# Altium schematic sheet 4-20mA.SchDoc
size A4; SheetNumber: 5; SheetTotal: 6
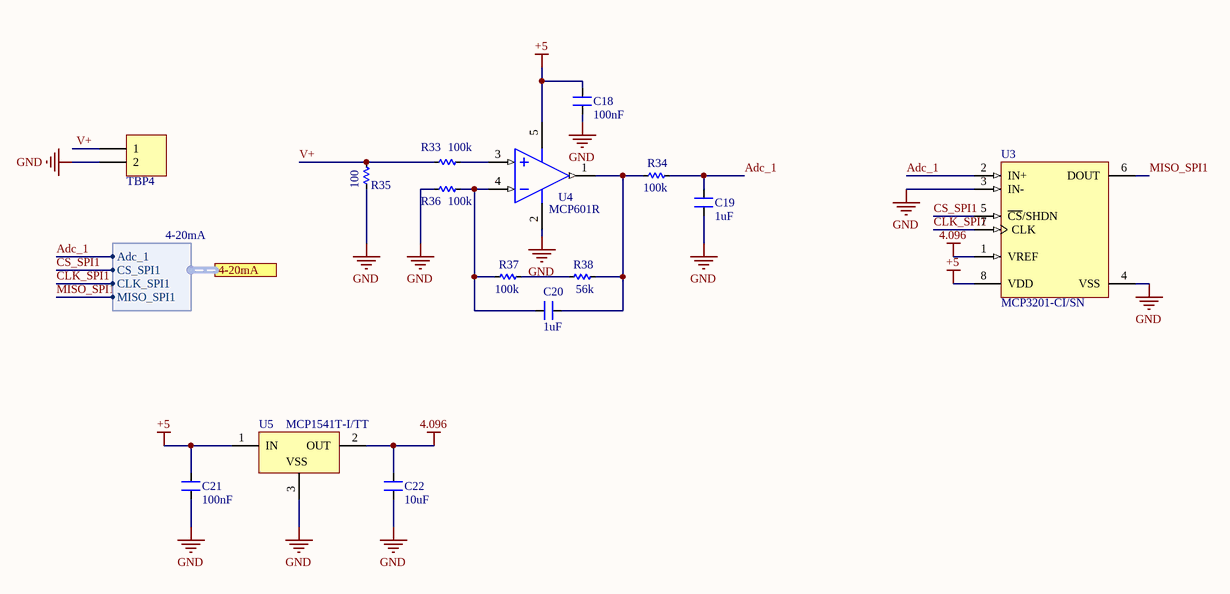
[diagram p0: 4-20mA.SchDoc]

## Parts
C18  100nF  [CN-SMD-0603]
C19  1uF  [CN-SMD-0603]
C20  1uF  [CN-SMD-0603]
C21  100nF  [CN-SMD-0603]
C22  10uF  [CN-SMD-0805]
R33  100k  [RES-SMD-0603]
R34  100k  [RES-SMD-0603]
R35  100  [RES-SMD-0603]
R36  100k  [RES-SMD-0603]
R37  100k  [RES-SMD-0603]
R38  56k  [RES-SMD-0603]
TBP4  WE-Terminal Blocks Plugable Type 691322310002  [Terminal_Blocks_Pluggable_Socket__Right_Angle__3.81_mm_Pitch__2_Position]  (value not drawn)
U3  MCP3201-CI/SN  [MCP3201]
U4  MCP601R  [MCP601]
U5  MCP1541T-I/TT  [MCP1541]

## Ports
4-20mA (harness 4-20mA)

## Harnesses
4-20mA: Adc_1, CS_SPI1, CLK_SPI1, MISO_SPI1

## Nets
4.096: C22.1 U3.1(VREF) U5.2(OUT)
+5: C18.2 C21.1 U3.8(VDD) U4.5(VSS) U5.1(IN)
GND: C18.1 C19.2 C21.2 C22.2 R35.2 R36.2 TBP4.2 U3.3(IN-) U3.4(VSS) U4.2(VDD) U5.3(VSS)
Adc_1: C19.1 R34.1 U3.2(IN+) ; port 4-20mA.Adc_1
CLK_SPI1: U3.7(CLK) ; port 4-20mA.CLK_SPI1
CS_SPI1: U3.5(~{CS}/SHDN) ; port 4-20mA.CS_SPI1
MISO_SPI1: U3.6(DOUT) ; port 4-20mA.MISO_SPI1
V+: R33.2 R35.1 TBP4.1
NetC20_1: C20.1 R34.2 R38.1 U4.1(VOUT)
NetC20_2: C20.2 R36.1 R37.2 U4.4(VIN-)
NetR33_1: R33.1 U4.3(VIN+)
NetR37_1: R37.1 R38.2

## Notes on the sheet
- Title
- Size:
- Date:
- A3
- Number:
- Time:
- Revision:
- Sheet
- of
- NICHIETSUVN.COM <http://NICHIETSUVN.COM>
- R&D
- File:

## Library data of the parts
C18-C22 = CN: Value: 33pF
R33-R38 = Res-SMD: Resistor; Manufacturer: Generic Components; Class: Passive; Published: 08/06/2000; Publisher: Altium Hobart Technology Centre
TBP4 = Terminal_Blocks_Pluggable_Socket__Right_Angle__3.81_mm_Pitch__2_Position: WR-TBL Terminal block - serie 322 - 3.81 mm; Manufacturer 1: W¨¹rth Elektronik eiSos GmbH; ComponentLink1 Description: Manufacturer; ComponentLink2 Description: Datasheet; NoPins: 02; Pcs 2: 1; ComponentLink1URL: http://www.we-online.com; ComponentLink2URL: http://katalog.we-online.de/em/datasheet/6913223100xx.pdf; Supplier 1: Digi-Key; Supplier Part Number 1: *; Supplier 2: https://www.thegioiic.com; Manufacturer Part Number 1: 691322310002; Supplier Part Number 2: https://www.thegioiic.com/products/kf-3-81-2-r-terminal-block-plug-in-han-pcb-2-chan-cong-3-81mm; Price 2: 2000
U3 = MCP3201-CI/SN: 2.7V 12-Bit A/D Converter with SPI Serial Interface, 8-Pin SOIC 150mil, C Performance Grade, Industrial Temperature; DatasheetVersion: revE, Dec-2008; Code_JEDEC: MS-012; Code_IPC: SOIC127P600-8; PackageVersion: revBB, Aug-2009; PackageDescription: 8-Lead Plastic Small Outline (SN) - Narrow, 3.90mm Body [SOIC]; PackageReference: SOIC-SN8; PartNumber: MCP3201-CI/SN
U4 = MCP601RT-I/OT: 2.7V to 6.0V Single Supply CMOS Operational Amplifier, 5-Pin SOT-23, Industrial Temperature, Tape and Reel; ComponentLink1Description: Manufacturer URL; ComponentLink2Description: Datasheet; DatasheetVersion: revG, Dec-2007; ComponentLink3URL: http://www.microchip.com/stellent/groups/techpub_sg/documents/packagingspec/en012702.pdf; ComponentLink3Description: Package Specification; ComponentLink1URL: http://www.microchip.com/; RevisionNote: URLs added.; Code_IPC: SOT23-5; PackageVersion: revBB, Aug-2009; PackageDescription: 5-Lead Plastic Small Outline Transistor (OT) [SOT-23]; ComponentLink2URL: http://ww1.microchip.com/downloads/en/DeviceDoc/21314g.pdf; PackageReference: SOT-23-OT5; PartNumber: MCP601RT-I/OT
U5 = MCP1541T-I/TT: 4.096V Voltage Reference, 3-Pin SOT-23, Industrial Temperature, Tape and Reel; Code_IPC: SOT23-3; PackageVersion: revBB, Aug-2009; DatasheetVersion: revB, Feb-2005; PackageDescription: 3-Lead Plastic Small Outline Transistor (TT) [SOT-23]; PackageReference: SOT-23-TT3; PartNumber: MCP1541T-I/TT